# EAGLE design Extension Board (EAGLE 6.4)
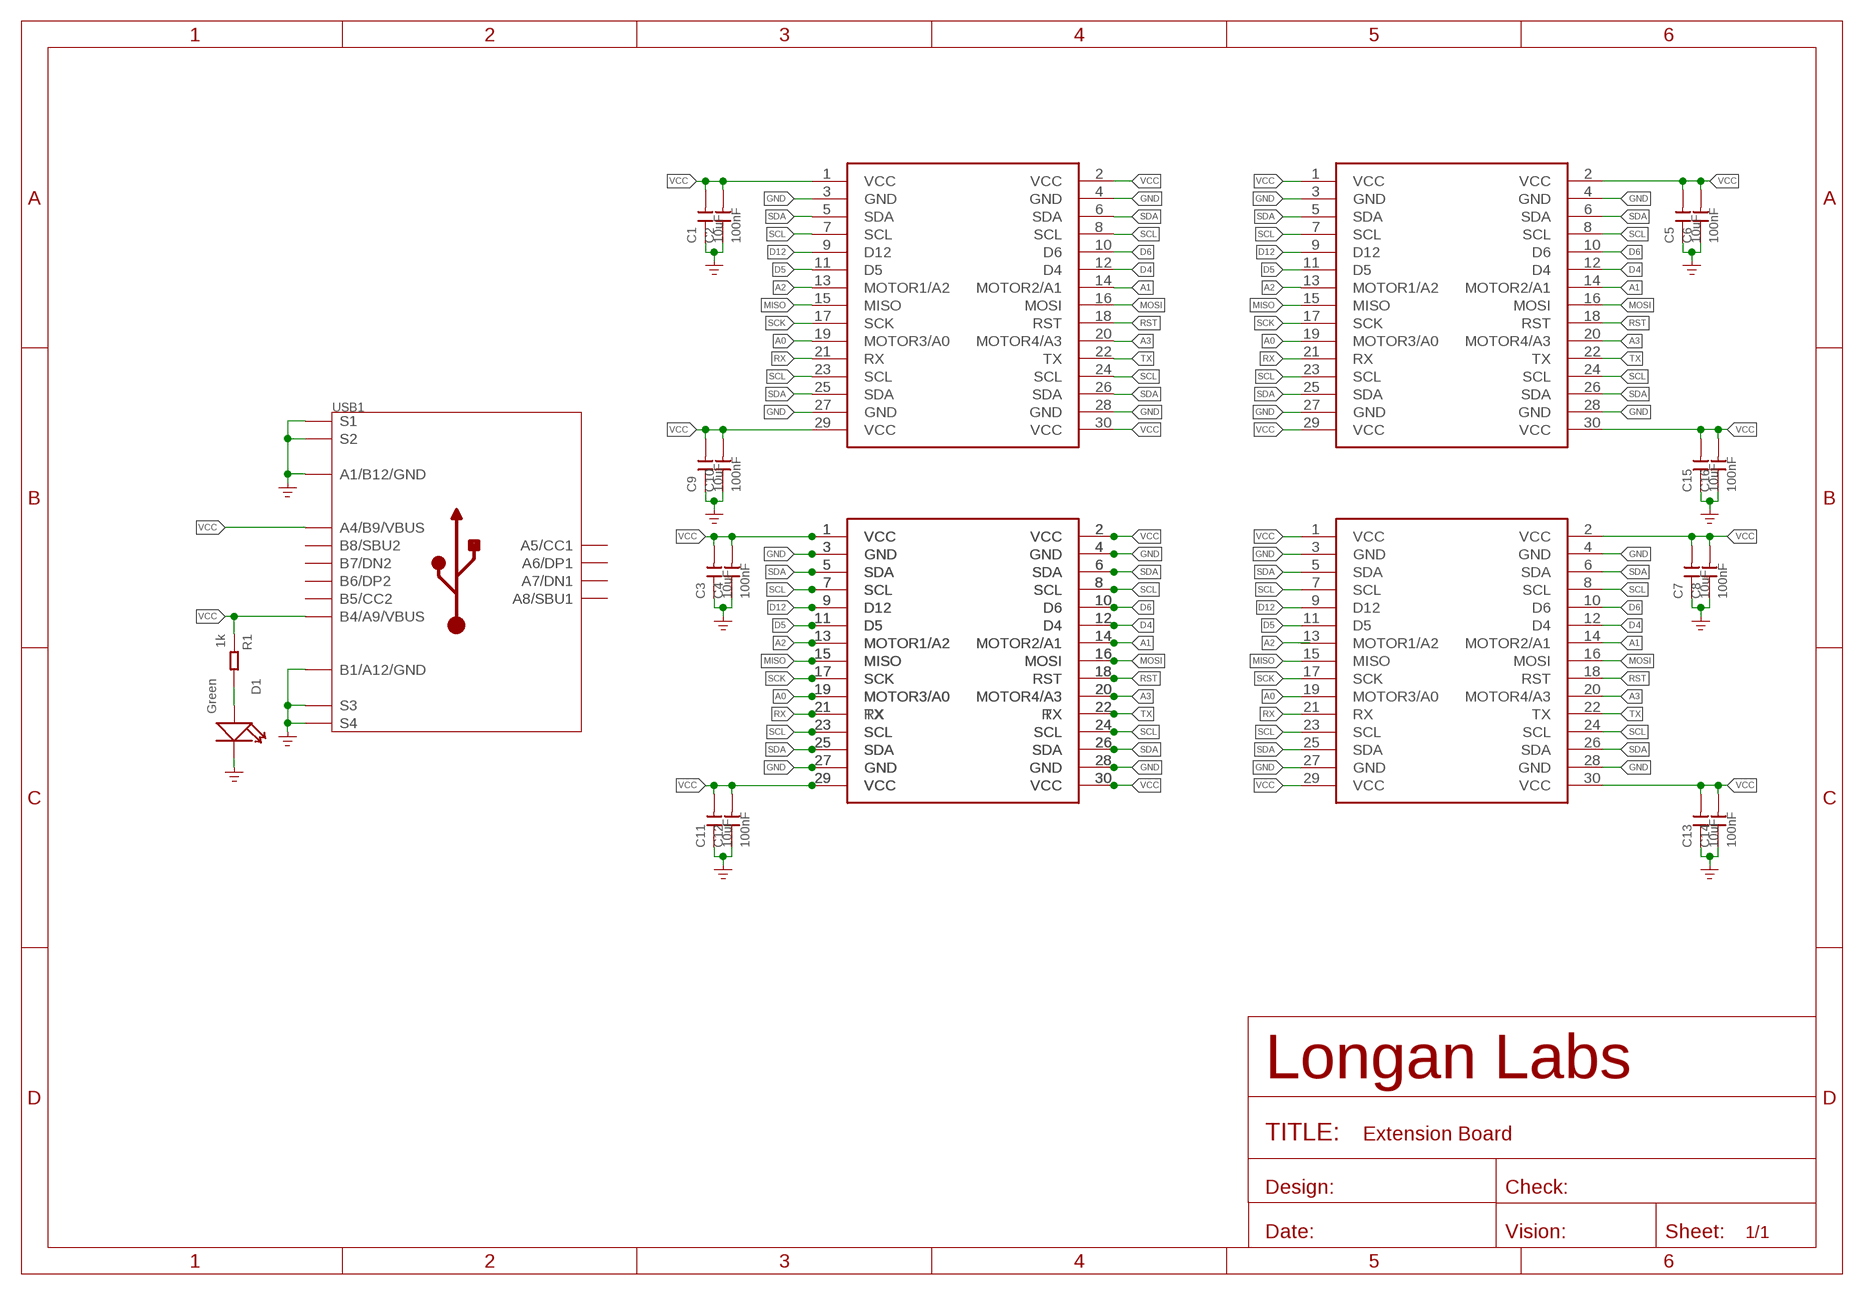
[diagram p0: schematic, sheet 1]

## Parts
C1  10uF  CAP-0603  [C0603]
C2  100nF  CAP-0603  [C0603]
C3  10uF  CAP-0603  [C0603]
C4  100nF  CAP-0603  [C0603]
C5  10uF  CAP-0603  [C0603]
C6  100nF  CAP-0603  [C0603]
C7  10uF  CAP-0603  [C0603]
C8  100nF  CAP-0603  [C0603]
C9  10uF  CAP-0603  [C0603]
C10  100nF  CAP-0603  [C0603]
C11  10uF  CAP-0603  [C0603]
C12  100nF  CAP-0603  [C0603]
C13  10uF  CAP-0603  [C0603]
C14  100nF  CAP-0603  [C0603]
C15  10uF  CAP-0603  [C0603]
C16  100nF  CAP-0603  [C0603]
D1  Green  LED'0603'  [LED-0603]
MOUDLE1  MOUDLE-2X15P-2.54'2.54'  [2X15P-2.54]
MOUDLE2  MOUDLE-2X15P-2.54'2.54'  [2X15P-2.54]
MOUDLE3  MOUDLE-2X15P-2.54'2.54'  [2X15P-2.54]
MOUDLE4  MOUDLE-2X15P-2.54'90D'  [2X15P-2.54-90D]
MOUDLE5  MOUDLE-2X15P-2.54-PAD'BOARD'  [MOUDLE-2X15P-2.54]
R1  1k  RES-0603  [R0603]
USB1  USB2.0-TYPE-C  [USB2.0-TYPE-C]

## Nets
A0: MOUDLE1.19(MOTOR3/A0) MOUDLE2.19(MOTOR3/A0) MOUDLE3.19(MOTOR3/A0) MOUDLE4.19(MOTOR3/A0) MOUDLE5.19(MOTOR3/A0)
A1: MOUDLE1.14(MOTOR2/A1) MOUDLE2.14(MOTOR2/A1) MOUDLE3.14(MOTOR2/A1) MOUDLE4.14(MOTOR2/A1) MOUDLE5.14(MOTOR2/A1)
A2: MOUDLE1.13(MOTOR1/A2) MOUDLE2.13(MOTOR1/A2) MOUDLE4.13(MOTOR1/A2) MOUDLE5.13(MOTOR1/A2)
A3: MOUDLE1.20(MOTOR4/A3) MOUDLE2.20(MOTOR4/A3) MOUDLE3.20(MOTOR4/A3) MOUDLE4.20(MOTOR4/A3) MOUDLE5.20(MOTOR4/A3)
D4: MOUDLE1.12(D4) MOUDLE2.12(D4) MOUDLE3.12(D4) MOUDLE4.12(D4) MOUDLE5.12(D4)
D5: MOUDLE1.11(D5) MOUDLE2.11(D5) MOUDLE3.11(D5) MOUDLE4.11(D5) MOUDLE5.11(D5)
D6: MOUDLE1.10(D6) MOUDLE2.10(D6) MOUDLE3.10(D6) MOUDLE4.10(D6) MOUDLE5.10(D6)
D12: MOUDLE1.9(D12) MOUDLE2.9(D12) MOUDLE3.9(D12) MOUDLE4.9(D12) MOUDLE5.9(D12)
GND: C1.1 C2.1 C3.1 C4.1 C5.1 C6.1 C7.1 C8.1 C9.1 C10.1 C11.1 C12.1 C13.1 C14.1 C15.1 C16.1 D1.- MOUDLE1.3(GND) MOUDLE1.4(GND) MOUDLE1.27(GND) MOUDLE1.28(GND) MOUDLE2.3(GND) MOUDLE2.4(GND) MOUDLE2.27(GND) MOUDLE2.28(GND) MOUDLE3.3(GND) MOUDLE3.4(GND) MOUDLE3.27(GND) MOUDLE3.28(GND) MOUDLE4.3(GND) MOUDLE4.4(GND) MOUDLE4.27(GND) MOUDLE4.28(GND) MOUDLE5.3(GND) MOUDLE5.4(GND) MOUDLE5.27(GND) MOUDLE5.28(GND) USB1.A1_B12(A1/B12/GND) USB1.B1_A12(B1/A12/GND) USB1.S1 USB1.S2 USB1.S3 USB1.S4 USB1.S5(S1) USB1.S6(S2) ; supply symbol labelled GND_POWER
MISO: MOUDLE1.15(MISO) MOUDLE2.15(MISO) MOUDLE3.15(MISO) MOUDLE4.15(MISO) MOUDLE5.15(MISO)
MOSI: MOUDLE1.16(MOSI) MOUDLE2.16(MOSI) MOUDLE3.16(MOSI) MOUDLE4.16(MOSI) MOUDLE5.16(MOSI)
N$2: D1.+ R1.2
RST: MOUDLE1.18(RST) MOUDLE2.18(RST) MOUDLE3.18(RST) MOUDLE4.18(RST) MOUDLE5.18(RST)
RX: MOUDLE1.21(RX) MOUDLE2.21(RX) MOUDLE3.21(RX) MOUDLE4.21(RX) MOUDLE5.21(TX)
SCK: MOUDLE1.17(SCK) MOUDLE2.17(SCK) MOUDLE3.17(SCK) MOUDLE4.17(SCK) MOUDLE5.17(SCK)
SCL: MOUDLE1.7(SCL) MOUDLE1.8(SCL) MOUDLE1.23(SCL) MOUDLE1.24(SCL) MOUDLE2.7(SCL) MOUDLE2.8(SCL) MOUDLE2.23(SCL) MOUDLE2.24(SCL) MOUDLE3.7(SCL) MOUDLE3.8(SCL) MOUDLE3.23(SCL) MOUDLE3.24(SCL) MOUDLE4.7(SCL) MOUDLE4.8(SCL) MOUDLE4.23(SCL) MOUDLE4.24(SCL) MOUDLE5.7(SCL) MOUDLE5.8(SCL) MOUDLE5.23(SCL) MOUDLE5.24(SCL)
SDA: MOUDLE1.5(SDA) MOUDLE1.6(SDA) MOUDLE1.25(SDA) MOUDLE1.26(SDA) MOUDLE2.5(SDA) MOUDLE2.6(SDA) MOUDLE2.25(SDA) MOUDLE2.26(SDA) MOUDLE3.5(SDA) MOUDLE3.6(SDA) MOUDLE3.25(SDA) MOUDLE3.26(SDA) MOUDLE4.5(SDA) MOUDLE4.6(SDA) MOUDLE4.25(SDA) MOUDLE4.26(SDA) MOUDLE5.5(SDA) MOUDLE5.6(SDA) MOUDLE5.25(SDA) MOUDLE5.26(SDA)
TX: MOUDLE1.22(TX) MOUDLE2.22(TX) MOUDLE3.22(TX) MOUDLE4.22(TX) MOUDLE5.22(RX)
VCC: C1.2 C2.2 C3.2 C4.2 C5.2 C6.2 C7.2 C8.2 C9.2 C10.2 C11.2 C12.2 C13.2 C14.2 C15.2 C16.2 MOUDLE1.1(VCC) MOUDLE1.2(VCC) MOUDLE1.29(VCC) MOUDLE1.30(VCC) MOUDLE2.1(VCC) MOUDLE2.2(VCC) MOUDLE2.29(VCC) MOUDLE2.30(VCC) MOUDLE3.1(VCC) MOUDLE3.2(VCC) MOUDLE3.29(VCC) MOUDLE3.30(VCC) MOUDLE4.1(VCC) MOUDLE4.2(VCC) MOUDLE4.29(VCC) MOUDLE4.30(VCC) MOUDLE5.1(VCC) MOUDLE5.2(VCC) MOUDLE5.29(VCC) MOUDLE5.30(VCC) R1.1 USB1.A4_B9(A4/B9/VBUS) USB1.B4_A9(B4/A9/VBUS)
Unconnected: MOUDLE3.13(MOTOR1/A2) USB1.A5(A5/CC1) USB1.A6(A6/DP1) USB1.A7(A7/DN1) USB1.A8(A8/SBU1) USB1.B5(B5/CC2) USB1.B6(B6/DP2) USB1.B7(B7/DN2) USB1.B8(B8/SBU2)

## Notes on the sheet
- E:/Dropbox/Longan/Cards/ԭÀíͼ/Card_25/1016007_Sensor_Display/image/ÕýÃæ.bmp

## Library data of the parts
C1-C16 = Discrete-new:CAP: Ceramic Capacitors
D1 = Discrete-new:LED
MOUDLE1-MOUDLE4 = Longan-moudle:MOUDLE-2X15P-2.54
MOUDLE5 = Longan-moudle-pad:MOUDLE-2X15P-2.54-PAD
R1 = Discrete-new:RES
USB1 = Connector-new:USB2.0-TYPE-C

## Net classes
0 default: width 0.152 mm, clearance 0.152 mm

## Board
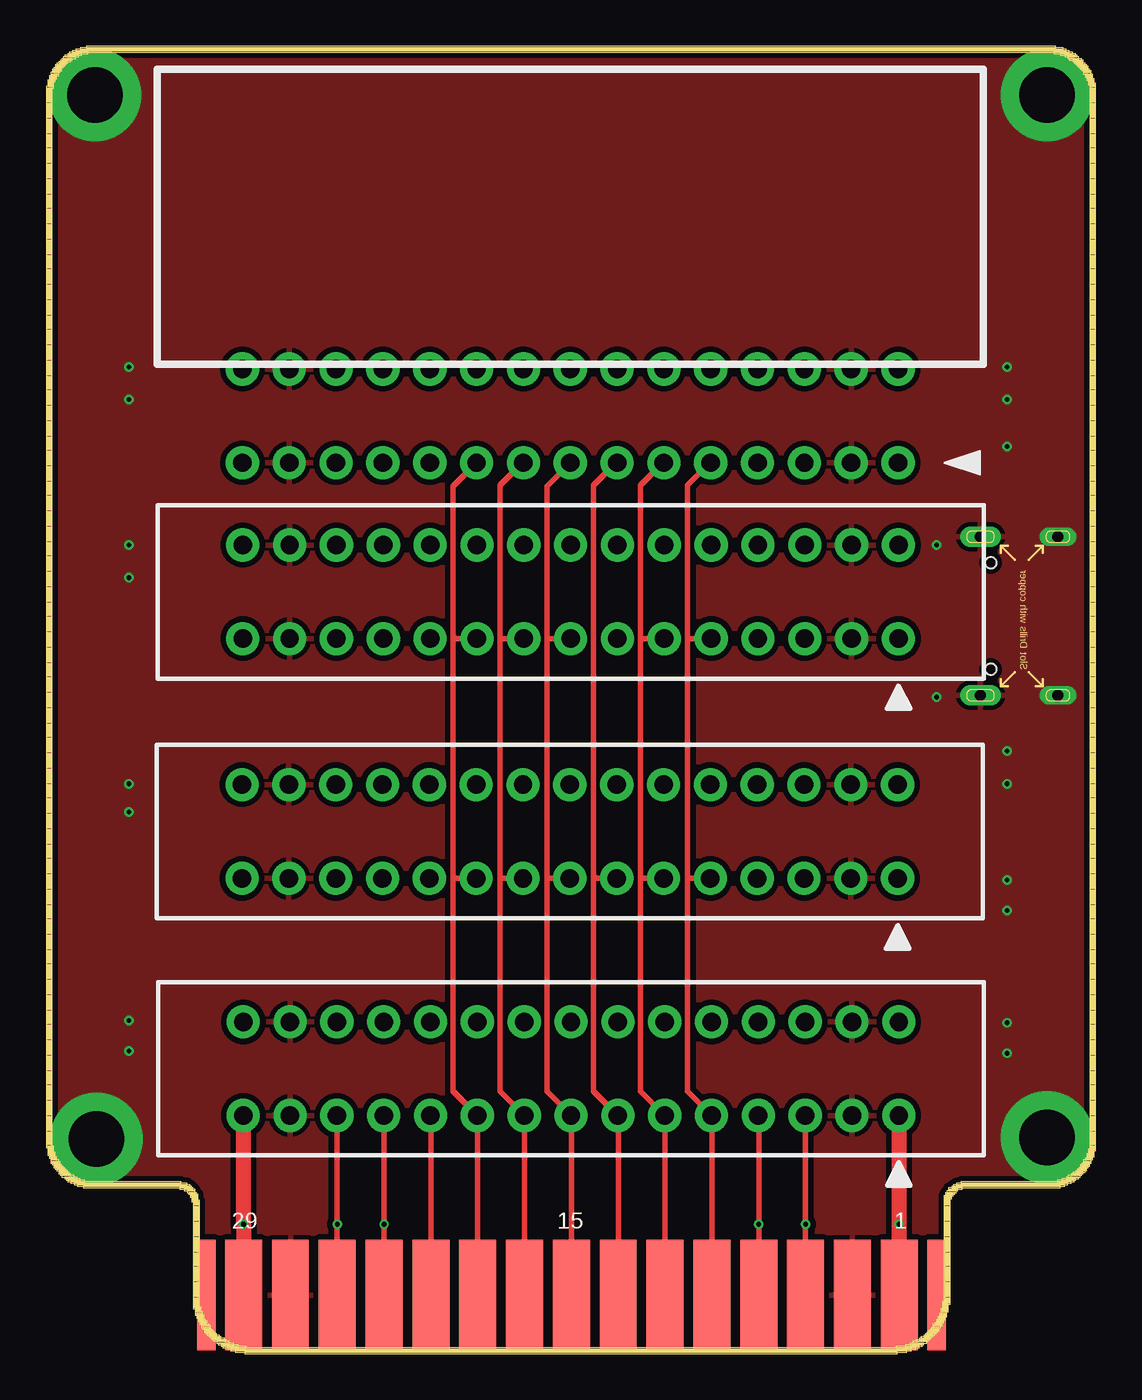
[diagram p1: board, top side]
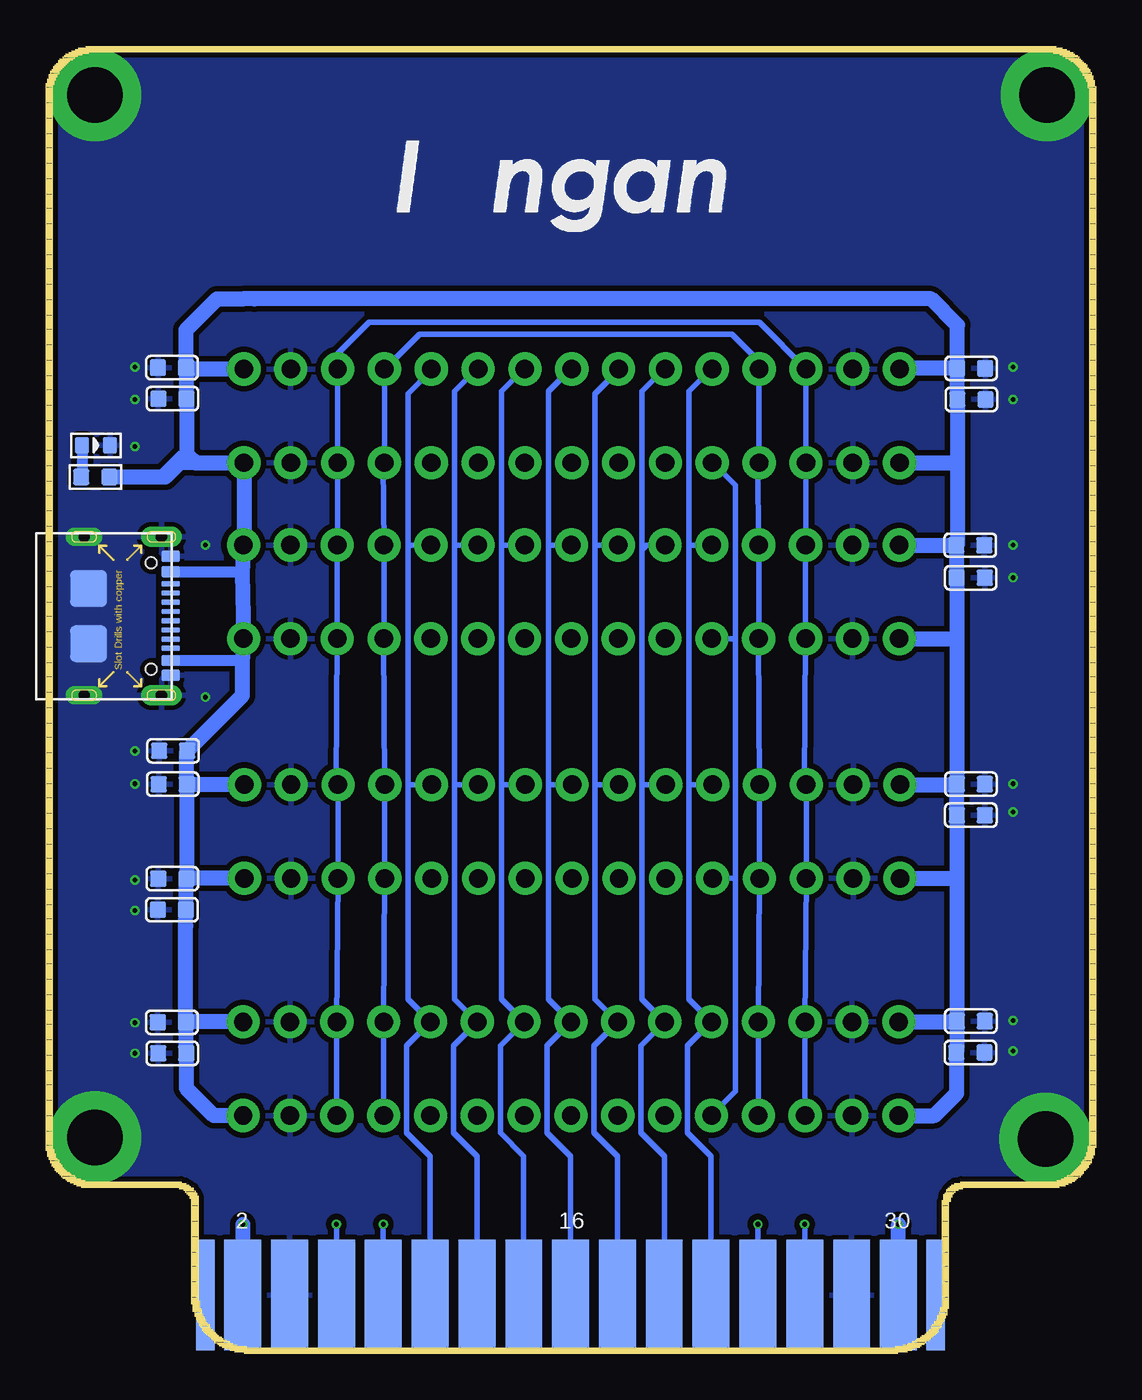
[diagram p2: board, bottom side, seen from below]

Size 56.94 x 70.9 mm. Coordinates in mm from the lower left corner, seen from the top.
Copper layers (1*16): Top 0.035mm / dielectric 1.5mm / Bottom 0.035mm
Design rules "SeeedStudio_2layer_DRU_no_angle_20140221": minimum track width 1mil, minimum drill 10mil, track to track 6mil, track to pad 6mil, pad to pad 6mil, via to via 6mil, smd to smd 0mil, copper to edge 10mil, drill to drill 10mil, minimum pad ring 4mil, minimum via ring 4mil, stop-mask expansion 2mil, vias tented up to drill 25mil, thermal gap 10mil

### Footprints (pad centres in the part's own frame; a part is rotated, then mirrored left to right if it is on the bottom)
C0603 = smd 0.889 x 0.889: 1 0,0.762; 2 0,-0.762
LED-0603 = smd 0.762 x 0.889: + -0.762,0; - 0.762,0
2X15P-2.54 = drill 1 pad 1.8: 1 -17.78,2.54; 2 -17.78,-2.54; 3 -15.24,2.54; 4 -15.24,-2.54; 5 -12.7,2.54; 6 -12.7,-2.54; 7 -10.16,2.54; 8 -10.16,-2.54; 9 -7.62,2.54; 10 -7.62,-2.54; 11 -5.08,2.54; 12 -5.08,-2.54; 13 -2.54,2.54; 14 -2.54,-2.54; 15 0,2.54; 16 0,-2.54; 17 2.54,2.54; 18 2.54,-2.54; 19 5.08,2.54; 20 5.08,-2.54; 21 7.62,2.54; 22 7.62,-2.54; 23 10.16,2.54; 24 10.16,-2.54; 25 12.7,2.54; 26 12.7,-2.54; 27 15.24,2.54; 28 15.24,-2.54; 29 17.78,2.54; 30 17.78,-2.54
2X15P-2.54-90D = drill 1 pad 1.8: 1 17.78,-13.335; 2 17.78,-8.255; 3 15.24,-13.335; 4 15.24,-8.255; 5 12.7,-13.335; 6 12.7,-8.255; 7 10.16,-13.335; 8 10.16,-8.255; 9 7.62,-13.335; 10 7.62,-8.255; 11 5.08,-13.335; 12 5.08,-8.255; 13 2.54,-13.335; 14 2.54,-8.255; 15 0,-13.335; 16 0,-8.255; 17 -2.54,-13.335; 18 -2.54,-8.255; 19 -5.08,-13.335; 20 -5.08,-8.255; 21 -7.62,-13.335; 22 -7.62,-8.255; 23 -10.16,-13.335; 24 -10.16,-8.255; 25 -12.7,-13.335; 26 -12.7,-8.255; 27 -15.24,-13.335; 28 -15.24,-8.255; 29 -17.78,-13.335; 30 -17.78,-8.255
MOUDLE-2X15P-2.54 = smd 2 x 6: 1 17.78,-13.492; 3 15.24,-13.492; 5 12.7,-13.492; 7 10.16,-13.492; 9 7.62,-13.492; 11 5.08,-13.492; 13 2.54,-13.492; 15 0,-13.492; 17 -2.54,-13.492; 19 -5.08,-13.492; 21 -7.62,-13.492; 23 -10.16,-13.492; 25 -12.7,-13.492; 27 -15.24,-13.492; 29 -17.78,-13.492 | smd 2 x 6 bottom: 2 17.78,-13.492; 4 15.24,-13.492; 6 12.7,-13.492; 8 10.16,-13.492; 10 7.62,-13.492; 12 5.08,-13.492; 14 2.54,-13.492; 16 0,-13.492; 18 -2.54,-13.492; 20 -5.08,-13.492; 22 -7.62,-13.492; 24 -10.16,-13.492; 26 -12.7,-13.492; 28 -15.24,-13.492; 30 -17.78,-13.492 | smd 1 x 6: P1 -19.8,-13.492; P4 19.8,-13.492 | smd 1 x 6 bottom: P2 -19.8,-13.492; P3 19.8,-13.492
R0603 = smd 0.889 x 0.889: 1 0,0.762; 2 0,-0.762
USB2.0-TYPE-C = smd 1 x 0.6: A1_B12 -0.05,3.25; A4_B9 -0.05,2.4; B1_A12 -0.05,-3.2; B4_A9 -0.05,-2.4 | smd 1 x 0.3: A5 -0.05,1.25; A6 -0.05,0.25; A7 -0.05,-0.25; A8 -0.05,-1.25; B5 -0.05,-1.75; B6 -0.05,-0.75; B7 -0.05,0.75; B8 -0.05,1.75 | drill 0.6 pad 1 long: S1 -4.75,4.3; S2 -4.75,-4.3 | drill 0.6 pad 1.1 long: S3 -0.55,4.3; S4 -0.55,-4.3 | smd 2 x 2: S5 -4.5,1.5; S6 -4.5,-1.5 | hole 0.6: -1.1,-2.89; -1.1,2.89

### Placement (x,y rotation side)
C1  6.78,18.04 270 bottom
C2  6.78,29.2 270 bottom
C3  50.09,16.29 90 bottom
C4  50.12,17.98 90 bottom
C5  6.8,16.34 270 bottom
C6  6.78,30.89 270 bottom
C7  50.09,25.76 90 bottom
C8  50.11,24.08 90 bottom
C9  50.04,32.69 90 bottom
C10  50.07,30.89 90 bottom
C11  50.08,51.78 90 bottom
C12  50.11,53.47 90 bottom
C13  6.81,43.84 270 bottom
C14  6.79,42.07 270 bottom
C15  6.77,53.43 270 bottom
C16  6.75,51.74 270 bottom
D1  54.23,49.25 0 bottom
MOUDLE1  28.47,15.46 180 top
MOUDLE2  28.41,28.32 180 top
MOUDLE3  28.45,41.31 180 top
MOUDLE4  28.43,61.64 0 top
MOUDLE5  28.49,16.68 0 top
R1  54.27,47.54 270 bottom
U$3  [LONGAN-COPPER-SMALL]  39.54,59.35 0 bottom
USB1  50.13,40 0 bottom

### Tracks (layer width: path | path; a pad name or v marks a point on that pad's centre or on a via)
A0
  Top 0.305: MOUDLE4.19 22.08,47.03 22.08,38.9 | 22.08,38.9 22.08,25.82 | 22.08,25.82 22.08,14.23 MOUDLE1.19 23.41,12.9 MOUDLE5.19 | MOUDLE2.19 22.12,25.78 22.08,25.82 | MOUDLE3.19 22.21,38.77 22.08,38.9
A1
  Bottom 0.305: MOUDLE4.14 31.02,53.39 32.24,52.18 32.24,43.86 | 32.24,43.86 32.24,30.9 | 32.24,30.9 32.24,19.23 MOUDLE1.14 32.3,16.71 32.3,11.98 31.03,10.71 MOUDLE5.14 | MOUDLE2.14 32.19,30.86 32.24,30.9 | MOUDLE3.14 32.23,43.85 32.24,43.86
A2
  Top 0.305: MOUDLE4.13 30.91,48.31 29.7,47.1 29.7,25.95 | 29.7,25.95 29.7,14.23 MOUDLE1.13 31.03,12.9 MOUDLE5.13 | MOUDLE2.13 29.87,25.78 29.7,25.95
A3
  Bottom 0.305: MOUDLE4.20 23.4,53.39 24.62,52.18 24.62,43.6 | 24.62,43.6 24.62,30.78 | 24.62,30.78 24.62,19.23 MOUDLE1.20 24.68,16.71 24.68,11.98 23.41,10.71 MOUDLE5.20 | MOUDLE3.20 24.37,43.85 24.62,43.6 | MOUDLE2.20 24.53,30.86 24.62,30.78
D4
  Bottom 0.305: MOUDLE4.12 33.56,53.39 34.78,52.18 34.78,43.86 | 34.78,43.86 34.78,30.78 | 34.78,30.78 34.78,19.23 MOUDLE1.12 34.84,16.71 34.84,11.98 33.57,10.71 MOUDLE5.12 | MOUDLE2.12 34.69,30.86 34.78,30.78 | MOUDLE3.12 34.77,43.85 34.78,43.86
D5
  Top 0.305: MOUDLE4.11 33.45,48.31 32.24,47.1 32.24,38.65 | 32.24,38.65 32.24,25.7 | 32.24,25.7 32.24,14.23 MOUDLE1.11 33.57,12.9 MOUDLE5.11 | MOUDLE2.11 32.32,25.78 32.24,25.7 | MOUDLE3.11 32.36,38.77 32.24,38.65
D6
  Bottom 0.305: MOUDLE4.10 36.05,53.32 37.32,52.05 37.32,43.73 | 37.32,43.73 37.32,30.9 | 37.32,30.9 37.32,19.23 MOUDLE1.10 37.38,16.71 37.38,11.98 36.11,10.71 MOUDLE5.10 | MOUDLE2.10 37.27,30.86 37.32,30.9 | MOUDLE3.10 37.2,43.85 37.32,43.73
D12
  Top 0.305: MOUDLE4.9 35.99,48.31 34.78,47.1 34.78,38.78 | 34.78,38.78 34.78,25.82 | 34.78,25.82 34.78,14.23 MOUDLE1.9 36.11,12.9 MOUDLE5.9 | MOUDLE2.9 34.82,25.78 34.78,25.82 | MOUDLE3.9 34.78,38.77 34.78,38.78
GND  (via drill 0.25 pad 0.51, 3 pad 5)
  other vias: 54.29,11.73 54.29,68.25 2.73,11.65 2.65,68.25 52.11,25.7 52.11,24.05 52.11,17.95 52.11,16.3 52.11,32.68 52.11,30.9 48.3,43.86 48.3,35.6 52.11,53.51 52.11,51.73 52.11,49.19 4.49,53.51 4.49,51.73 4.49,43.86 4.49,42.08 4.49,30.9 4.49,29.38 4.49,18.08 4.49,16.43
  pour Top (isolate 0.305): -0.21,72.94 58.46,72.94 58.46,-1.99 -0.21,-1.99
  pour Bottom (isolate 0.305): -0.21,72.94 58.46,72.94 58.46,-1.99 -0.21,-1.99
MISO
  Top 0.305: MOUDLE4.15 27.16,47.03 27.16,38.78 | 27.16,38.78 27.16,25.82 | 27.16,25.82 27.16,14.23 MOUDLE1.15 28.49,12.9 MOUDLE5.15 | MOUDLE2.15 27.2,25.78 27.16,25.82 | MOUDLE3.15 27.16,38.77 27.16,38.78
MOSI
  Bottom 0.305: MOUDLE4.16 28.48,53.39 29.7,52.18 29.7,43.86 | 29.7,43.86 29.7,30.78 | 29.7,30.78 29.7,19.23 MOUDLE1.16 29.76,16.71 29.76,11.98 28.49,10.71 MOUDLE5.16 | MOUDLE2.16 29.61,30.86 29.7,30.78 | MOUDLE3.16 29.69,43.85 29.7,43.86
N$2
  Bottom 0.61: D1.+ 54.99,47.58 R1.2
RST
  Bottom 0.305: MOUDLE4.18 25.89,53.32 27.16,52.05 27.16,43.73 | 27.16,43.73 27.16,30.9 | 27.16,30.9 27.16,19.23 MOUDLE1.18 27.22,16.71 27.22,11.98 25.95,10.71 MOUDLE5.18 | MOUDLE2.18 27.11,30.86 27.16,30.9 | MOUDLE3.18 27.04,43.85 27.16,43.73
RX
  Top 0.305: MOUDLE5.21 20.87,12.9 MOUDLE1.21
  Bottom 0.305: MOUDLE4.21 20.75,48.31 19.54,47.1 19.54,38.65 | 19.54,38.65 19.54,25.7 | 19.54,25.7 19.54,14.23 MOUDLE1.21 | MOUDLE2.21 19.62,25.78 19.54,25.7 | MOUDLE3.21 19.66,38.77 19.54,38.65
SCK
  Top 0.305: MOUDLE4.17 25.83,48.31 24.62,47.1 24.62,38.78 | 24.62,38.78 24.62,25.82 | 24.62,25.82 24.62,14.23 MOUDLE1.17 25.95,12.9 MOUDLE5.17 | MOUDLE2.17 24.66,25.78 24.62,25.82 | MOUDLE3.17 24.62,38.77 24.62,38.78
SCL  (via drill 0.25 pad 0.51)
  Top 0.305: MOUDLE5.24 v18.33,7.03 18.33,12.9 MOUDLE1.23 | MOUDLE5.8 v38.65,7.03 38.65,12.9 MOUDLE1.7
  Bottom 0.305: MOUDLE1.7 MOUDLE1.8 MOUDLE2.7 MOUDLE2.8 38.63,38.73 MOUDLE3.7 MOUDLE3.8 38.67,48.23 MOUDLE4.7 MOUDLE4.8 36.69,55.29 19.73,55.29 18.27,53.83 MOUDLE4.24 MOUDLE4.23 18.35,48.23 MOUDLE3.24 MOUDLE3.23 18.31,38.73 MOUDLE2.24 MOUDLE2.23 MOUDLE1.24 MOUDLE1.23 18.31,12.76 | v18.33,7.03 MOUDLE5.24 | v38.65,7.03 MOUDLE5.8
SDA  (via drill 0.25 pad 0.51)
  Top 0.305: MOUDLE5.26 v15.79,7.03 15.79,12.9 MOUDLE1.25 | MOUDLE5.6 v41.19,7.03 41.19,12.9 MOUDLE1.5
  Bottom 0.305: MOUDLE1.25 MOUDLE1.26 MOUDLE2.25 MOUDLE2.26 15.81,30.9 MOUDLE3.25 MOUDLE3.26 15.73,43.94 MOUDLE4.25 MOUDLE4.26 18.26,55.92 39.41,55.92 41.13,54.21 MOUDLE4.6 MOUDLE4.5 41.13,43.94 MOUDLE3.6 MOUDLE3.5 41.21,30.9 MOUDLE2.6 MOUDLE2.5 MOUDLE1.6 MOUDLE1.5 | v15.79,7.03 MOUDLE5.26 | v41.19,7.03 MOUDLE5.6
TX
  Bottom 0.305: MOUDLE4.22 20.86,53.39 22.08,52.18 22.08,43.86 | 22.08,43.86 22.08,30.9 | 22.08,30.9 22.08,19.23 MOUDLE1.22 22.14,16.71 22.14,11.98 20.87,10.71 MOUDLE5.22 | MOUDLE2.22 22.03,30.86 22.08,30.9 | MOUDLE3.22 22.07,43.85 22.08,43.86
VCC  (via drill 0.25 pad 0.51)
  Top 0.813: MOUDLE5.30 v10.71,7.03 10.71,12.9 MOUDLE1.29 | MOUDLE5.2 v46.27,7.03 46.27,12.9 MOUDLE1.1
  Bottom 0.61: USB1.A4_B9 46.35,42.4 46.29,42.33 | USB1.B4_A9 46.38,37.6 46.29,37.51
  Bottom 0.813: MOUDLE4.30 10.61,53.43 C15.2 7.53,51.77 C16.2 | C16.2 7.51,48.3 | 7.51,48.3 7.51,43.9 C13.2 | C13.2 7.55,43.82 C14.2 7.55,38.65 | 7.55,38.65 7.55,30.9 C6.2 | C6.2 C2.2 7.55,25.82 | 7.55,25.82 C1.2 | C1.2 7.55,16.36 C5.2 7.57,14.11 8.76,12.92 MOUDLE1.29 10.71,12.9 | MOUDLE1.30 7.59,18 C1.2 | MOUDLE2.29 7.59,25.78 7.55,25.82 | MOUDLE2.30 7.57,30.86 C6.2 | MOUDLE3.30 7.59,43.85 C13.2 | MOUDLE3.29 7.67,38.77 7.55,38.65 | MOUDLE4.29 7.52,48.31 7.51,48.3 | C12.2 49.35,51.81 C11.2 49.32,48.82 49.25,48.75 | MOUDLE4.2 49.27,53.39 C12.2 | C4.2 49.33,17.95 C3.2 49.33,14.41 47.84,12.92 MOUDLE1.1 | C4.2 49.35,23.19 C8.2 49.35,24.85 C7.2 | MOUDLE2.1 49.31,25.78 C7.2 | C10.2 49.31,25.78 C7.2 | C10.2 49.31,32.67 C9.2 46.29,35.69 46.29,37.51 MOUDLE3.1 46.29,42.33 MOUDLE3.2 46.21,43.94 MOUDLE4.1 48.81,48.3 | MOUDLE2.2 49.28,30.86 C10.2 | MOUDLE1.2 49.33,18 C4.2 | 49.25,48.75 48.81,48.3 | R1.1 50.59,47.54 | 50.59,47.54 50.46,47.54 49.7,48.3 | 49.7,48.3 49.25,48.75 | 48.81,48.3 49.7,48.3 | 50.59,47.54 49.45,48.68 | C16.2 7.51,55.77 8.93,57.19 45.64,57.19 46.27,57.19 47.67,57.19 49.35,55.51 C12.2 | MOUDLE5.30 v10.71,7.03 | v46.27,7.03 MOUDLE5.2